# Altium schematic sheet IO.SchDoc
size A4; SheetNumber: 2; SheetTotal: 4
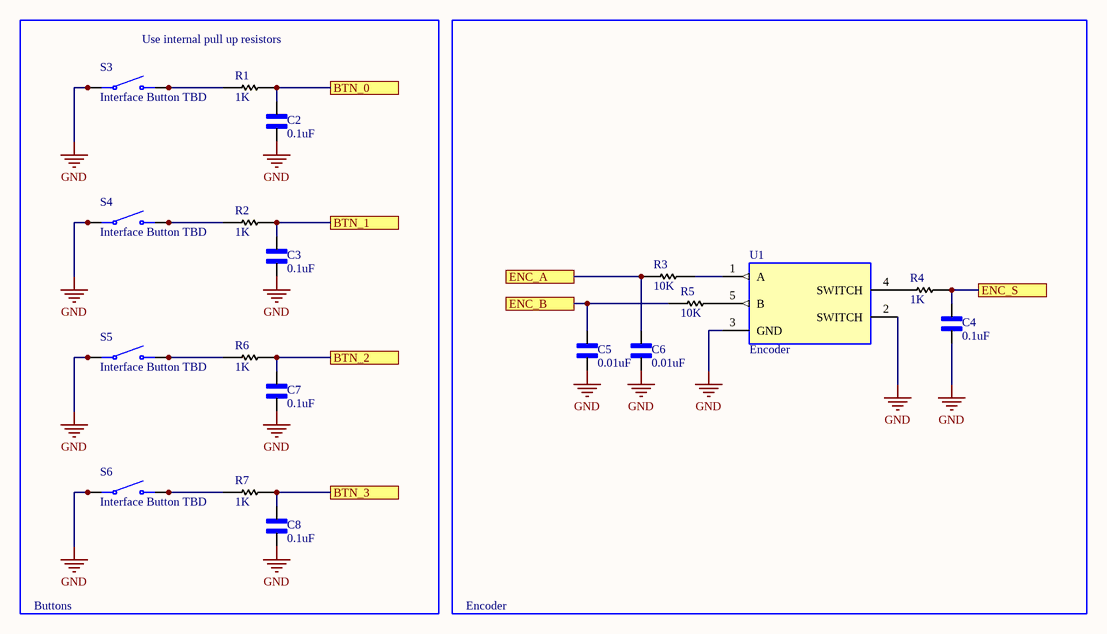
[diagram p0: IO.SchDoc]

## Parts
C2  0.1uF  [CHIP_0603]
C3  0.1uF  [CHIP_0603]
C4  0.1uF  [CHIP_0603]
C5  0.01uF  [CHIP_0603]
C6  0.01uF  [CHIP_0603]
C7  0.1uF  [CHIP_0603]
C8  0.1uF  [CHIP_0603]
R1  1K  [CHIP_R_0603]
R2  1K  [CHIP_R_0603]
R3  10K  [CHIP_R_0603]
R4  1K  [CHIP_R_0603]
R5  10K  [CHIP_R_0603]
R6  1K  [CHIP_R_0603]
R7  1K  [CHIP_R_0603]
S3  Interface Button TBD  [Interface_Button_Multi_Footprint]
S4  Interface Button TBD  [Interface_Button_Multi_Footprint]
S5  Interface Button TBD  [Interface_Button_Multi_Footprint]
S6  Interface Button TBD  [Interface_Button_Multi_Footprint]
U1  Encoder  [Encoder Solder Pads]

## Blocks framed on the sheet
Encoder: C4-C6 R3-R5 U1

## Ports
BTN_0, BTN_1, BTN_2, BTN_3, ENC_A, ENC_B, ENC_S

## Nets
GND: C2.2 C3.2 C4.2 C5.2 C6.2 C7.2 C8.2 S3.1(COM) S3.2(COM) S4.1(COM) S4.2(COM) S5.1(COM) S5.2(COM) S6.1(COM) S6.2(COM) U1.2(SWITCH) U1.3(GND)
BTN_0: C2.1 R1.1 ; port BTN_0
BTN_1: C3.1 R2.1 ; port BTN_1
BTN_2: C7.1 R6.1 ; port BTN_2
BTN_3: C8.1 R7.1 ; port BTN_3
ENC_A: C6.1 R3.2 ; port ENC_A
ENC_B: C5.1 R5.2 ; port ENC_B
ENC_S: C4.1 R4.1 ; port ENC_S
NetR1_2: R1.2 S3.3(NO) S3.4(NO)
NetR2_2: R2.2 S4.3(NO) S4.4(NO)
NetR3_1: R3.1 U1.1(A)
NetR4_2: R4.2 U1.4(SWITCH)
NetR5_1: R5.1 U1.5(B)
NetR6_2: R6.2 S5.3(NO) S5.4(NO)
NetR7_2: R7.2 S6.3(NO) S6.4(NO)

## Notes on the sheet
- Use internal pull up resistors
- Buttons

## Library data of the parts
C2-C8 = 0603 Ceramic Capacitor: Generic 0603 Ceramic Capacitor; MP: AC0402FR-071ML; MF: Yageo; Package: 1005 Yageo; SnapEDA_Link: https://www.snapeda.com/parts/AC0402FR-071ML/Yageo/view-part/940461/?ref=snap; Value: *; Mouser-Purchase-URL: https://snapeda.com/shop?store=Mouser&id=940461; DigiKey-Purchase-URL: https://snapeda.com/shop?store=DigiKey&id=940461
R1-R7 = 0603 Generic Resistor: Generic 0603 Resistor
S3-S6 = Interface Button TBD: TBD
U1 = Encoder: Encoder solder connections for PEC11R-4215F-S0024; MF: Diodes Inc.; MP: AP3012KTR-G1; Package: SOT-23-5 Diodes Inc.; Value: *; Availability: Unavailable; SnapEDA_Link: https://www.snapeda.com/parts/AP3012KTR-G1/Diodes%20Inc./view-part/587030/?ref=snap; Price: None